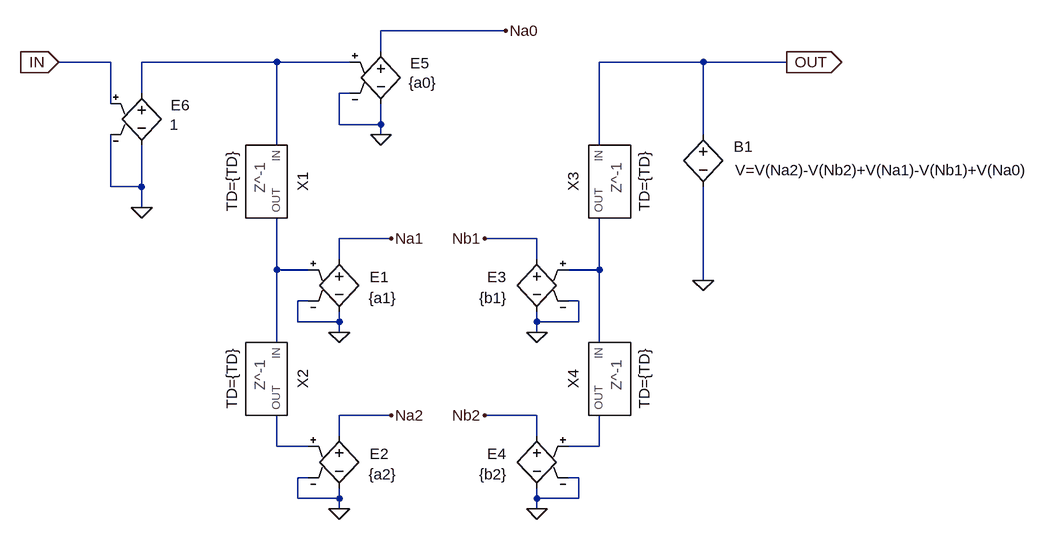
[diagram p0: schematic Type_2_digital.asc]
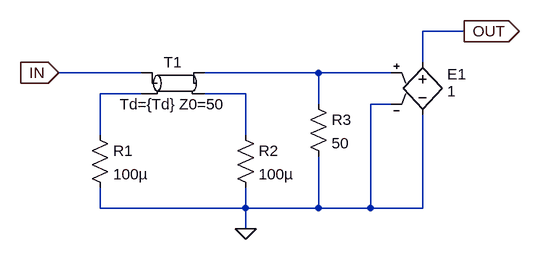
[diagram p1: sub-circuit zminus1.asc]
Type_2_digital.asc, the LTspice schematic file:
Version 4
SHEET 1 1788 680
WIRE 544 -368 352 -368
WIRE 352 -336 352 -368
WIRE -64 -320 -144 -320
WIRE 192 -320 -16 -320
WIRE 304 -320 192 -320
WIRE 848 -320 688 -320
WIRE 976 -320 848 -320
WIRE -16 -272 -16 -320
WIRE 304 -272 288 -272
WIRE -64 -256 -64 -320
WIRE 288 -224 288 -272
WIRE 352 -224 352 -256
WIRE 352 -224 288 -224
WIRE 352 -208 352 -224
WIRE 848 -208 848 -320
WIRE 192 -192 192 -320
WIRE 688 -192 688 -320
WIRE -64 -128 -64 -208
WIRE -16 -128 -16 -192
WIRE -16 -128 -64 -128
WIRE -16 -96 -16 -128
WIRE 368 -48 288 -48
WIRE 592 -48 512 -48
WIRE 288 -16 288 -48
WIRE 592 -16 592 -48
WIRE 192 0 192 -80
WIRE 240 0 192 0
WIRE 688 0 688 -80
WIRE 688 0 640 0
WIRE 848 16 848 -128
WIRE 240 48 224 48
WIRE 656 48 640 48
WIRE 224 80 224 48
WIRE 288 80 288 64
WIRE 288 80 224 80
WIRE 592 80 592 64
WIRE 656 80 656 48
WIRE 656 80 592 80
WIRE 288 96 288 80
WIRE 592 96 592 80
WIRE 192 112 192 0
WIRE 688 112 688 0
WIRE 368 224 288 224
WIRE 592 224 512 224
WIRE 288 256 288 224
WIRE 592 256 592 224
WIRE 192 272 192 224
WIRE 240 272 192 272
WIRE 688 272 688 224
WIRE 688 272 640 272
WIRE 240 320 224 320
WIRE 656 320 640 320
WIRE 224 352 224 320
WIRE 288 352 288 336
WIRE 288 352 224 352
WIRE 592 352 592 336
WIRE 656 352 656 320
WIRE 656 352 592 352
WIRE 288 368 288 352
WIRE 592 368 592 352
FLAG 288 96 0
FLAG 288 368 0
FLAG 368 -48 Na1
FLAG 368 224 Na2
FLAG 592 96 0
FLAG 592 368 0
FLAG 512 -48 Nb1
FLAG 512 224 Nb2
FLAG 352 -208 0
FLAG 544 -368 Na0
FLAG 848 16 0
FLAG 976 -320 OUT
IOPIN 976 -320 Out
FLAG -144 -320 IN
IOPIN -144 -320 In
FLAG -16 -96 0
SYMBOL Zminus1 192 -144 R90
WINDOW 39 7 85 Bottom 2
SYMATTR SpiceLine TD={TD}
SYMATTR InstName X1
SYMBOL Zminus1 192 160 R90
WINDOW 39 7 85 Bottom 2
SYMATTR SpiceLine TD={TD}
SYMATTR InstName X2
SYMBOL e 288 -32 R0
WINDOW 0 47 43 Left 2
WINDOW 3 45 75 Left 2
SYMATTR InstName E1
SYMATTR Value {a1}
SYMBOL e 288 240 R0
WINDOW 0 47 43 Left 2
WINDOW 3 45 75 Left 2
SYMATTR InstName E2
SYMATTR Value {a2}
SYMBOL Zminus1 688 -144 M90
WINDOW 39 7 85 Bottom 2
SYMATTR SpiceLine TD={TD}
SYMATTR InstName X3
SYMBOL Zminus1 688 160 M90
WINDOW 39 7 85 Bottom 2
SYMATTR SpiceLine TD={TD}
SYMATTR InstName X4
SYMBOL e 592 -32 M0
WINDOW 0 47 43 Left 2
WINDOW 3 45 75 Left 2
SYMATTR InstName E3
SYMATTR Value {b1}
SYMBOL e 592 240 M0
WINDOW 0 47 43 Left 2
WINDOW 3 45 75 Left 2
SYMATTR InstName E4
SYMATTR Value {b2}
SYMBOL e 352 -352 R0
WINDOW 0 45 34 Left 2
WINDOW 3 43 64 Left 2
SYMATTR InstName E5
SYMATTR Value {a0}
SYMBOL bv 848 -224 R0
WINDOW 0 47 34 Left 2
WINDOW 3 49 70 Left 2
SYMATTR InstName B1
SYMATTR Value V=V(Na2)-V(Nb2)+V(Na1)-V(Nb1)+V(Na0)
SYMBOL e -16 -288 R0
WINDOW 0 45 34 Left 2
WINDOW 3 43 64 Left 2
SYMATTR InstName E6
SYMATTR Value 1

zminus1.asc, the sub-circuit schematic file:
Version 4
SHEET 1 880 680
WIRE 624 80 560 80
WIRE 560 128 560 80
WIRE 128 144 0 144
WIRE 400 144 224 144
WIRE 512 144 400 144
WIRE 128 176 64 176
WIRE 288 176 224 176
WIRE 400 192 400 144
WIRE 512 192 480 192
WIRE 64 240 64 176
WIRE 288 240 288 176
WIRE 64 352 64 320
WIRE 288 352 288 320
WIRE 288 352 64 352
WIRE 400 352 400 272
WIRE 400 352 288 352
WIRE 480 352 480 192
WIRE 480 352 400 352
WIRE 560 352 560 208
WIRE 560 352 480 352
WIRE 288 384 288 352
FLAG 624 80 OUT
IOPIN 624 80 Out
FLAG 0 144 IN
IOPIN 0 144 In
FLAG 288 384 0
SYMBOL tline 176 160 R0
SYMATTR InstName T1
SYMATTR Value Td={Td} Z0=50
SYMBOL res 48 224 R0
SYMATTR InstName R1
SYMATTR Value 100µ
SYMBOL res 272 224 R0
SYMATTR InstName R2
SYMATTR Value 100µ
SYMBOL res 384 176 R0
SYMATTR InstName R3
SYMATTR Value 50
SYMBOL e 560 112 R0
WINDOW 0 38 34 Left 2
WINDOW 3 38 60 Left 2
SYMATTR InstName E1
SYMATTR Value 1

The netlist it stands for:
* Type_2_digital.asc
XX1 N001 N002 zminus1 params: TD={TD}
XX2 N002 N004 zminus1 params: TD={TD}
E1 Na1 0 N002 0 {a1}
E2 Na2 0 N004 0 {a2}
XX3 OUT N003 zminus1 params: TD={TD}
XX4 N003 N005 zminus1 params: TD={TD}
E3 Nb1 0 N003 0 {b1}
E4 Nb2 0 N005 0 {b2}
E5 Na0 0 N001 0 {a0}
B1 OUT 0 V=V(Na2)-V(Nb2)+V(Na1)-V(Nb1)+V(Na0)
E6 N001 0 IN 0 1

* block symbol definitions
.subckt zminus1 IN OUT
T1 IN N002 N001 N003 Td={Td} Z0=50
R1 N002 0 100µ
R2 N003 0 100µ
R3 N001 0 50
E1 OUT 0 N001 0 1
.ends zminus1

.backanno
.end